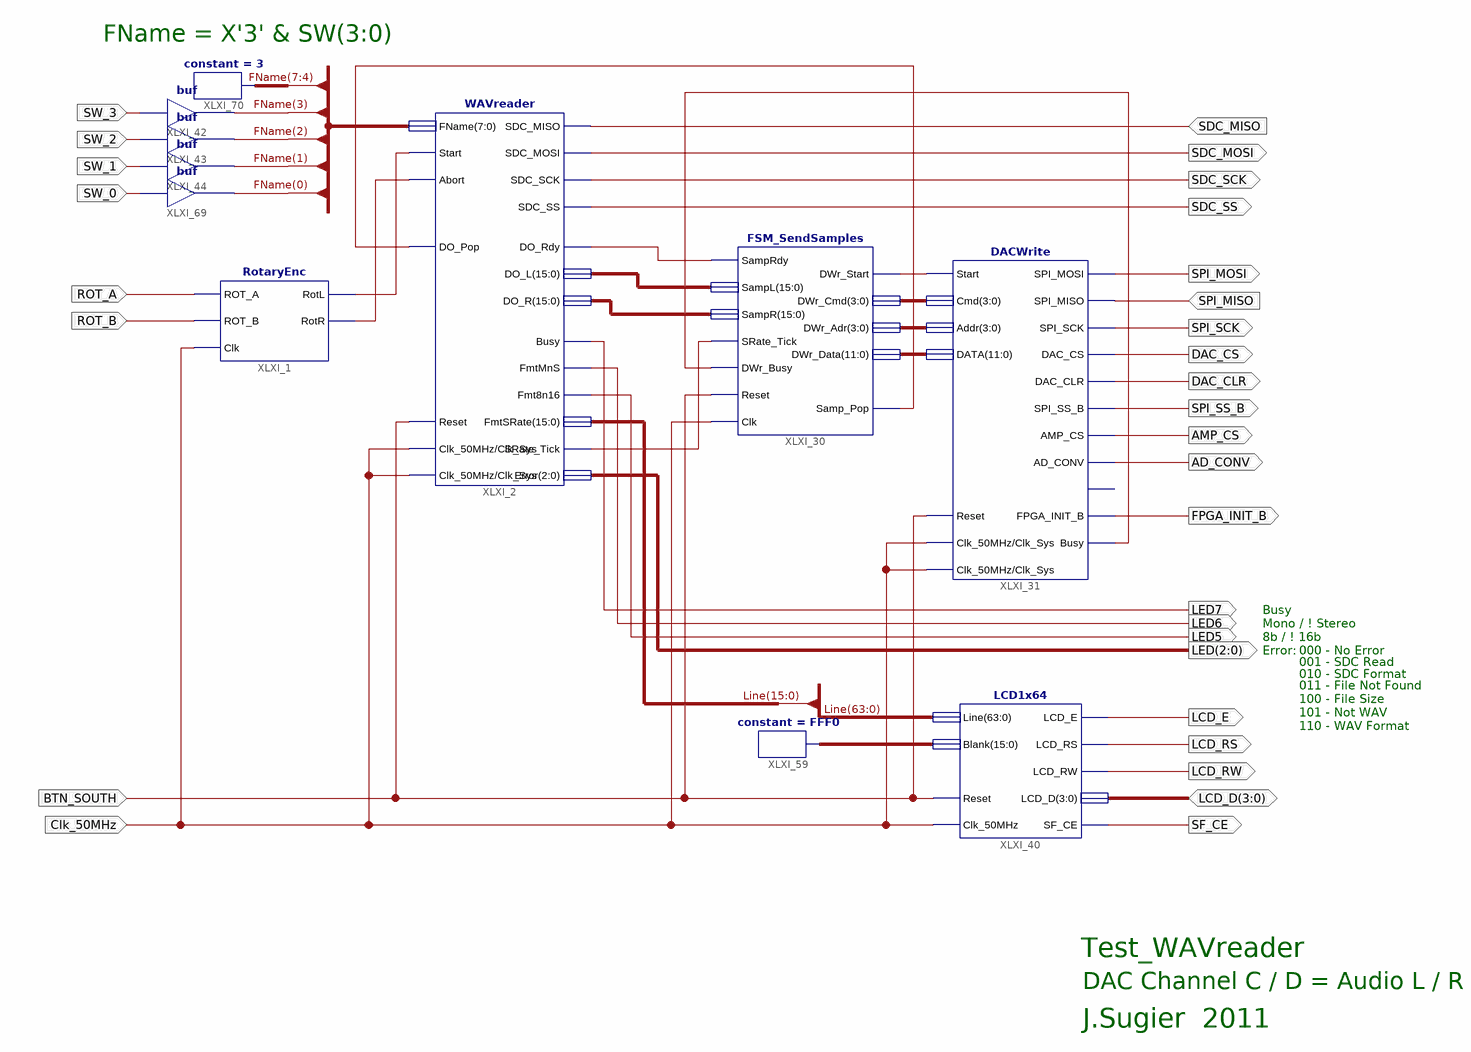
[diagram p0: schematic sheet 1]
// Xilinx ISE schematic Test_WAVreader.sch (spartan3e) as structural Verilog: 11 symbols, 30 ports
module Test_WAVreader (
  input  BTN_SOUTH,
  input  SDC_MISO,
  input  SPI_MISO,
  input  Clk_50MHz,
  input  SW_3,
  input  SW_2,
  input  SW_1,
  input  SW_0,
  input  ROT_A,
  input  ROT_B,
  inout  [3:0] LCD_D,
  output SDC_SS,
  output SDC_SCK,
  output SDC_MOSI,
  output LED7,
  output LED6,
  output LED5,
  output SPI_SS_B,
  output AMP_CS,
  output AD_CONV,
  output FPGA_INIT_B,
  output SPI_MOSI,
  output SPI_SCK,
  output DAC_CS,
  output DAC_CLR,
  output [2:0] LED,
  output LCD_E,
  output LCD_RS,
  output LCD_RW,
  output SF_CE
);

  wire XLXN_326, XLXN_327, XLXN_377, XLXN_383, XLXN_388, XLXN_395, XLXN_396;
  wire [3:0] XLXN_389, XLXN_390;
  wire [7:0] FName;
  wire [11:0] XLXN_391;
  wire [15:0] XLXN_378, XLXN_379, XLXN_549;
  wire [63:0] Line;

  WAVreader XLXI_2 (
    .FName(FName), .Start(XLXN_326), .Abort(XLXN_327), .SDC_MOSI(SDC_MOSI), .SDC_SCK(SDC_SCK),
    .SDC_SS(SDC_SS), .SDC_MISO(SDC_MISO), .DO_Rdy(XLXN_377), .DO_L(XLXN_378), .DO_R(XLXN_379),
    .DO_Pop(XLXN_395), .Busy(LED7), .FmtMnS(LED6), .Fmt8n16(LED5), .FmtSRate(Line[15:0]),
    .SRate_Tick(XLXN_383), .Error(LED), .Reset(BTN_SOUTH), .Clk_50MHz(Clk_50MHz), .Clk_Sys(Clk_50MHz));
  FSM_SendSamples XLXI_30 (
    .DWr_Busy(XLXN_396), .SampRdy(XLXN_377), .SampL(XLXN_378), .SampR(XLXN_379), .SRate_Tick(XLXN_383),
    .Reset(BTN_SOUTH), .Clk(Clk_50MHz), .DWr_Start(XLXN_388), .DWr_Cmd(XLXN_389), .DWr_Adr(XLXN_390),
    .DWr_Data(XLXN_391), .Samp_Pop(XLXN_395));
  DACWrite XLXI_31 (
    .Reset(BTN_SOUTH), .Start(XLXN_388), .SPI_MISO(SPI_MISO), .Cmd(XLXN_389), .Addr(XLXN_390),
    .DATA(XLXN_391), .DAC_CLR(DAC_CLR), .DAC_CS(DAC_CS), .SPI_MOSI(SPI_MOSI), .SPI_SCK(SPI_SCK),
    .SPI_SS_B(SPI_SS_B), .AMP_CS(AMP_CS), .AD_CONV(AD_CONV), .FPGA_INIT_B(FPGA_INIT_B), .Busy(XLXN_396),
    .Clk_50MHz(Clk_50MHz), .Clk_Sys(Clk_50MHz));  // open: SF_CE0
  constant #(.CValue("FFF0")) XLXI_59 (.O(XLXN_549));
  LCD1x64 XLXI_40 (
    .Clk_50MHz(Clk_50MHz), .Reset(BTN_SOUTH), .Line(Line), .Blank(XLXN_549), .LCD_D(LCD_D), .LCD_E(LCD_E),
    .LCD_RW(LCD_RW), .LCD_RS(LCD_RS), .SF_CE(SF_CE));
  buf XLXI_42 (FName[3], SW_3);
  buf XLXI_43 (FName[2], SW_2);
  buf XLXI_44 (FName[1], SW_1);
  buf XLXI_69 (FName[0], SW_0);
  RotaryEnc XLXI_1 (.ROT_A(ROT_A), .ROT_B(ROT_B), .RotL(XLXN_326), .RotR(XLXN_327), .Clk(Clk_50MHz));
  constant #(.CValue("3")) XLXI_70 (.O(FName[7:4]));

  // Notes on the sheet:
  //   FName = X'3' & SW(3:0)
  //   Busy
  //   Mono / ! Stereo
  //   8b / ! 16b
  //   Error:
  //   000 - No Error
  //   001 - SDC Read
  //   010 - SDC Format
  //   011 - File Not Found
  //   100 - File Size
  //   101 - Not WAV
  //   110 - WAV Format
  //   Test_WAVreader
  //   DAC Channel C / D = Audio L / R
  //   J.Sugier  2011
endmodule
